# EAGLE design module (EAGLE 7.1.0)
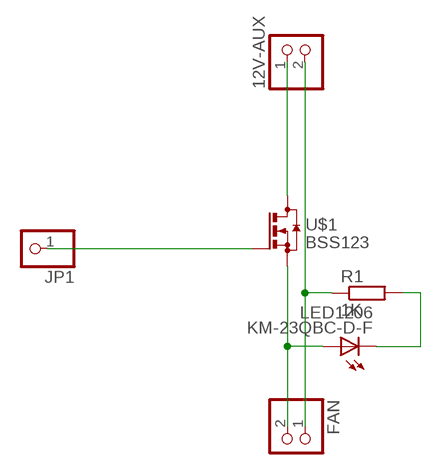
[diagram p0: schematic, sheet 1]

## Parts
12V-AUX  PINHD-1X2  [1X02]
FAN  PINHD-1X2  [1X02]
JP1  PINHD-1X1  [1X01]
KM-23QBC-D-F  LED1206  [LED1206]
R1  1K  R-EU_R1206  [R1206]
U$1  BSS123  [SOT23]

## Nets
N$1: JP1.1 U$1.1(G)
N$2: FAN.2 KM-23QBC-D-F.A U$1.2(S)
N$3: 12V-AUX.1 U$1.3(D)
N$4: 12V-AUX.2 FAN.1 R1.1
N$7: KM-23QBC-D-F.C R1.2

## Library data of the parts
12V-AUX FAN = pinhead:PINHD-1X2: PIN HEADER
JP1 = pinhead:PINHD-1X1: PIN HEADER
KM-23QBC-D-F = Namenlos:LED1206
R1 = rcl:R-EU_: RESISTOR, European symbol
U$1 = transistor-small-signal:BSS123: N-CHANNEL MOS FET

## Board
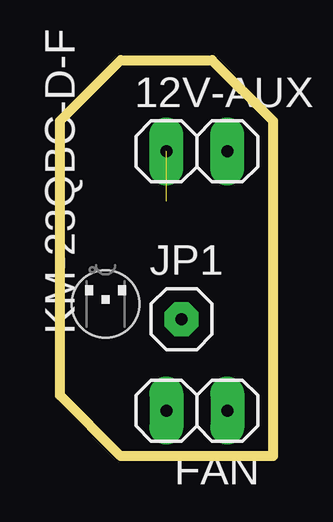
[diagram p1: board, top side]
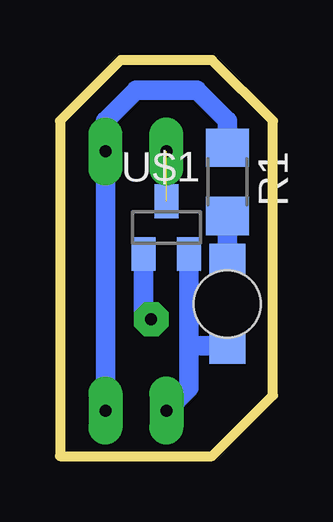
[diagram p2: board, bottom side, seen from below]

Size 8.89 x 16.51 mm. Coordinates in mm from the lower left corner, seen from the top.
Outline: 8.89,0 2.54,0 0,2.54 0,13.97 2.54,16.51 6.35,16.51 8.89,13.97 8.89,0
Copper layers (1*16): Top 0.035mm / dielectric 1.5mm / Bottom 0.035mm
Design rules "default": minimum track width 10mil, minimum drill 24mil, track to track 8mil, track to pad 8mil, pad to pad 8mil, via to via 8mil, smd to smd 8mil, copper to edge 40mil, drill to drill 8mil, minimum pad ring 10mil, minimum via ring 8mil, stop-mask expansion 4mil, vias tented up to drill 0mil, thermal gap 10mil

### Footprints (pad centres in the part's own frame; a part is rotated, then mirrored left to right if it is on the bottom)
1X02 = drill 0.5 pad 1.422 long: 1 -1.27,0; 2 1.27,0
1X01 = drill 0.5 pad 1.422 octagon: 1 0,0
LED1206 = smd 1.5 x 1.5 bottom: A 0,-1.75; C 0,1.75 | hole 2.8: 0,0
R1206 = smd 1.6 x 1.803: 1 -1.422,0; 2 1.422,0
SOT23 = smd 1 x 1.4: 1 -0.95,-1.1; 2 0.95,-1.1; 3 0,1.1

### Placement (x,y rotation side)
12V-AUX  5.71,12.7 0 top
FAN  5.71,1.91 180 top
JP1  5.08,5.71 0 top
KM-23QBC-D-F  1.91,6.35 0 top
R1  1.91,11.43 270 bottom
U$1  4.45,9.53 0 bottom

### Tracks (layer width: path | path; a pad name or v marks a point on that pad's centre or on a via)
N$1
  Bottom 0.813: U$1.1 5.39,6.03 JP1.1
N$2
  Bottom 0.813: U$1.2 3.5,4.45 | 3.5,4.45 3.5,2.85 FAN.2 | KM-23QBC-D-F.A 3.34,4.6 3.5,4.45
N$3  (1 unrouted)
N$4
  Bottom 0.813: FAN.1 12V-AUX.2 6.98,13.97 5.71,15.24 3.18,15.24 1.91,13.97 R1.1
N$7
  Bottom 0.813: KM-23QBC-D-F.C R1.2